# Altium schematic sheet Camera.SchDoc: Camera Module
size A4; DrawnBy: byu17; Organization: ENEL429 Group 9; Address1: ECE Department; Address2: University of Canterbury; Address3: Christchurch 8041; Address4: New Zealand; Revision: 1; SheetNumber: 2; SheetTotal: 4
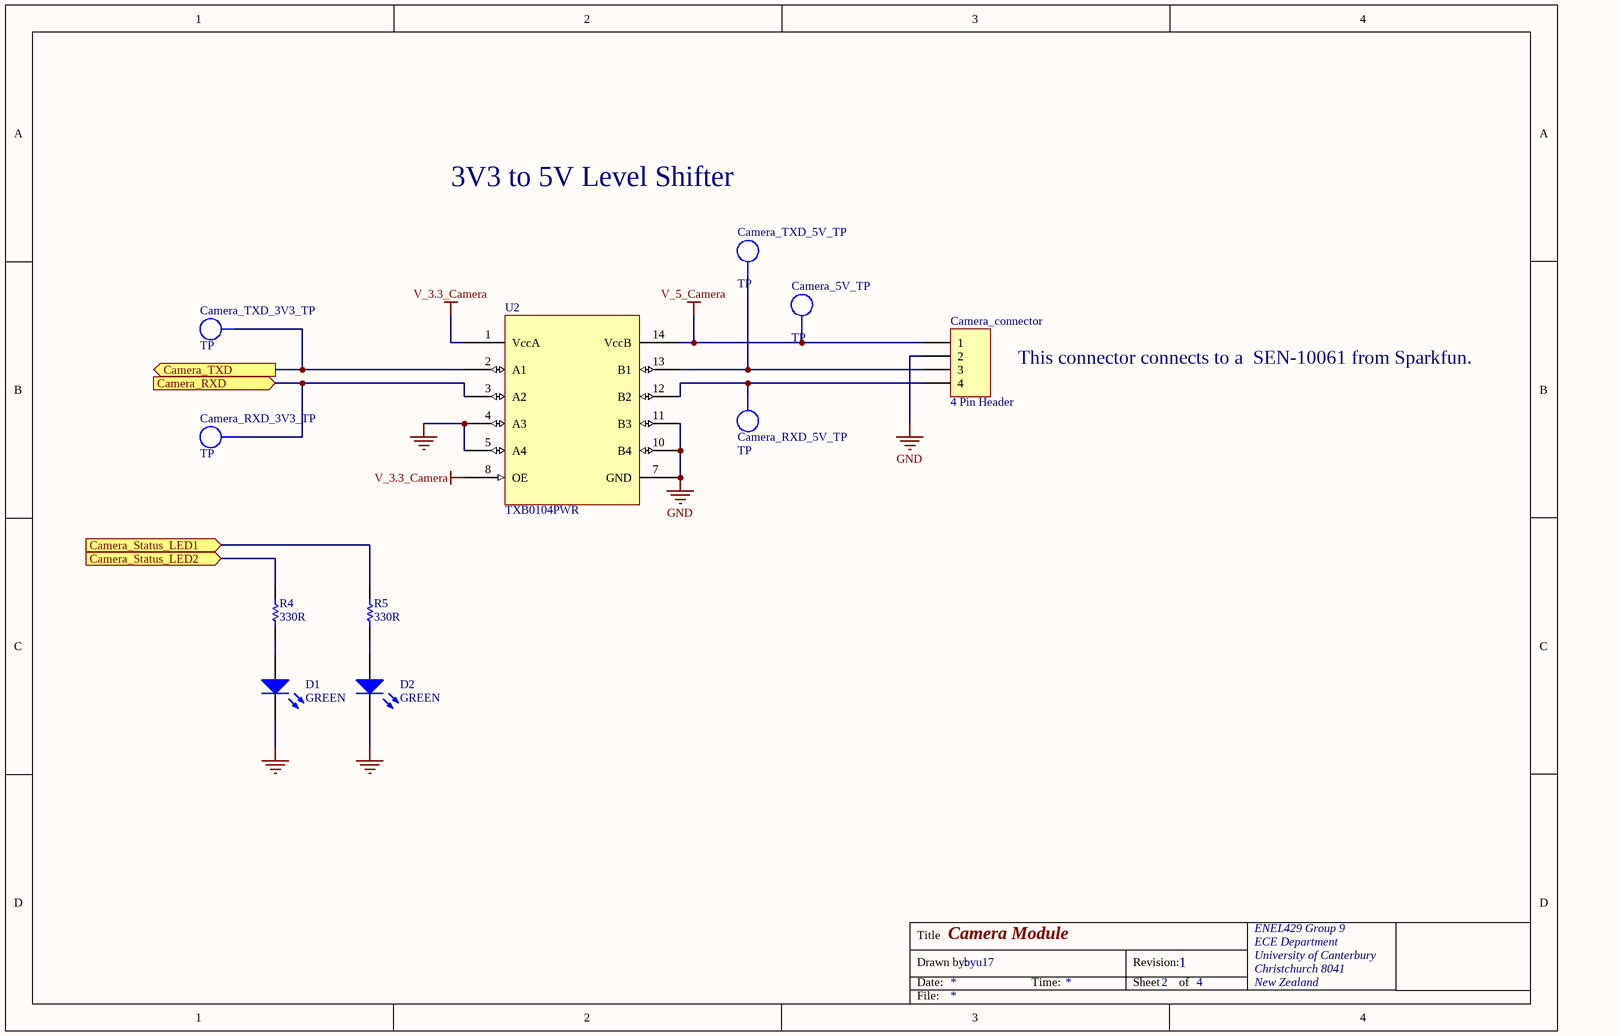
[diagram p0: Camera.SchDoc]

## Parts
Camera_5V_TP  TP  [TEST_POINT_4X2MM]  (no BOM)
Camera_connector  4 Pin Header  [CONN_4X1_SMT_RA_1.25MM]
Camera_RXD_3V3_TP  TP  [TEST_POINT_4X2MM]  (no BOM)
Camera_RXD_5V_TP  TP  [TEST_POINT_4X2MM]  (no BOM)
Camera_TXD_3V3_TP  TP  [TEST_POINT_4X2MM]  (no BOM)
Camera_TXD_5V_TP  TP  [TEST_POINT_4X2MM]  (no BOM)
D1  value GREEN  [DIODE_0805]  (hidden comment: LED Green)
D2  value GREEN  [DIODE_0805]  (hidden comment: LED Green)
R4  330R  [0603]
R5  330R  [0603]
U2  value TXB0104PWR  [TSSOP-14_PW]  (hidden comment: IC_TXB0104PWR)

## Ports
Camera_RXD (in), Camera_Status_LED1 (in), Camera_Status_LED2 (in), Camera_TXD (out)

## Nets
GND: Camera_connector.2 D1.2(K) D2.2(K) U2.4(A3) U2.5(A4) U2.7(GND) U2.10(B4) U2.11(B3)
V_3.3_Camera: U2.1(VccA) U2.8(OE)
V_5_Camera: Camera_5V_TP.1 Camera_connector.1 U2.14(VccB)
Camera_RXD: Camera_RXD_3V3_TP.1 U2.3(A2) ; port Camera_RXD
Camera_Status_LED1: R5.1 ; port Camera_Status_LED1
Camera_Status_LED2: R4.1 ; port Camera_Status_LED2
Camera_TXD: Camera_TXD_3V3_TP.1 U2.2(A1) ; port Camera_TXD
NetCamera_connector_3: Camera_connector.3 Camera_TXD_5V_TP.1 U2.13(B1)
NetCamera_connector_4: Camera_connector.4 Camera_RXD_5V_TP.1 U2.12(B2)
NetD1_1: D1.1(A) R4.2
NetD2_1: D2.1(A) R5.2

## Notes on the sheet
- 3V3 to 5V Level Shifter
- This connector connects to a  SEN-10061 from Sparkfun.
- Title
- Drawn by:
- Date:
- Time:
- Revision:
- Sheet
- of
- File:

## Library data of the parts
Camera_5V_TP Camera_RXD_3V3_TP Camera_RXD_5V_TP Camera_TXD_3V3_TP Camera_TXD_5V_TP = TP_TESTPOINT: Test-Point; LatestRevisionDate: 29 May 08; Manufacturer PN: *; Manufacturer: *; Supplier 1: Digi-Key; Supplier Part Number 1: 5016KTR-ND; Value: TP; Part Number: TP_TESTPOINT; Component Type: Standard (No BOM); Designator: TP_TESTPOINT; Pin Count: 1
Camera_connector = JP_4PIN HDR_SMT_RA_MOLEX_1: CONN HDR VERT 4POS .100" SNGL; Manufacturer: Molex; Manufacturer PN: 53261-0471; Verify: Not Checked; LatestRevisionDate: 24 Jun 08; Supplier 1: Digi-Key; Supplier Part Number 1: WM7622CT-ND; Value: 4 Pin Header; Part Number: JP_4PIN HDR_SMT_RA_MOLEX_1; Component Kind: Standard; Component Type: Standard; Designator: JP_4PIN HDR_SMT_RA_MOLEX_1; Pin Count: 4
D1 D2 = DL_LED Green 0805: Green LED 0805; Manufacturer: Vishay; Verify: Not checked; Part Number: DL_LED Green 0805; Component Kind: Standard; Component Type: Standard; Designator: DL_LED Green 0805; Footprint: LED_RA_SMD; Pin Count: 2; Supplier 1: Digi-Key; Supplier Part Number 1: 160-1179-2-ND; Simulation: LED0
R4 R5 = RS_330R 0603: RES 330 OHM 1/10W 1% 0603 SMD; Manufacturer: Yageo; Manufacturer PN: RC0603FR-07330RL; Value: 330R; Part Number: RS_330R 0603; Component Kind: Standard; Component Type: Standard; Designator: RS_330R 0603; Pin Count: 2; LatestRevisionDate: 25 June 2009; Supplier 1: Digi-Key; Supplier Part Number 1: 311-330HRTR-ND; Signal Integrity: Res; Simulation: RESISTOR
U2 = IC_TXB0104PWR: IC VOLT-LEVEL TRANSLATOR 14TSSOP; Manufacturer: Texas Instruments; Verify: Not Checked; Manufacturer PN: TXB0104PWR; Supplier 1: Digi-Key; Supplier Part Number 1: 296-21929-1-ND; Part Number: IC_TXB0104PWR; Component Kind: Standard; Component Type: Standard; Designator: IC_TXB0104PWR; Pin Count: 12